# Altium schematic sheet Sheet1.SchDoc
size A
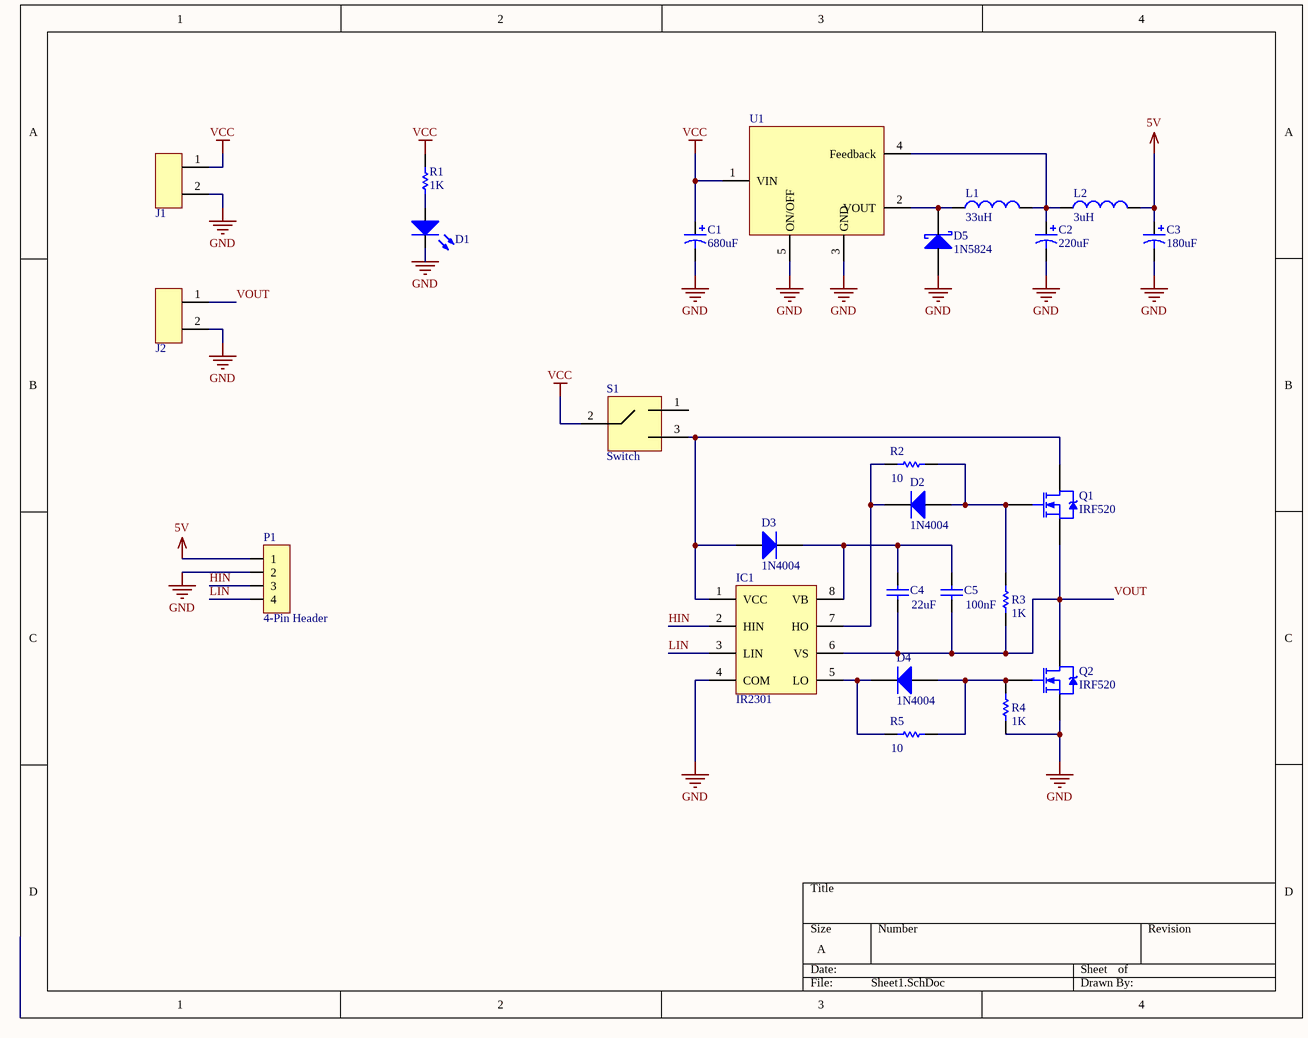
[diagram p0: Sheet1.SchDoc]

## Parts
C1  value 680uF  [EEU-FM1V681]  (hidden comment: Cap Pol1)
C2  value 220uF  [EEU-FM1V221L]  (hidden comment: Cap Pol1)
C3  value 180uF  [EEU-FR1V181]  (hidden comment: Cap Pol1)
C4  value 22uF  [Axial Cap 0.5mm]  (hidden comment: Cap)
C5  value 100nF  [Axial Cap 0.5mm]  (hidden comment: Cap)
D1  LED  [RAD-0.1]  (value not drawn)
D2  1N4004  [DO-41]
D3  1N4004  [DO-41]
D4  1N4004  [DO-41]
D5  1N5824  [DO-201AD]
IC1  IR2301  [DIP-8]
J1  Screw Terminal  [ST-2]  (value not drawn)
J2  Screw Terminal  [ST-2]  (value not drawn)
L1  value 33uH  [Inductor 2307-V-RC]  (hidden comment: Inductor)
L2  value 3uH  [Inductor Dia: 8.8mm]  (hidden comment: Inductor)
P1  4-Pin Header  [HDR-4P]
Q1  IRF520  [TO-220AB]
Q2  IRF520  [TO-220AB]
R1  Resistance: 1K  [AXIAL-0.3]  (hidden comment: Resistor)
R2  value 10  [AXIAL-0.3]  (hidden comment: Res1)
R3  value 1K  [AXIAL-0.3]  (hidden comment: Res1)
R4  value 1K  [AXIAL-0.3]  (hidden comment: Res1)
R5  value 10  [AXIAL-0.3]  (hidden comment: Res1)
S1  Switch  [E101 Switch]
U1  Step-down switching regulator  [TO-220-5]  (value not drawn)

## Nets
5V: C3.1 L2.2 P1.1
GND: C1.2 C2.2 C3.2 D1.2(K) D5.2 IC1.4(COM) J1.2 J2.2 P1.2 Q2.3(S) R4.1 U1.3(GND) U1.5(ON/OFF)
VCC: C1.1 J1.1 R1.2 S1.2(IN) U1.1(VIN)
HIN: IC1.2(HIN) P1.3
LIN: IC1.3(LIN) P1.4
VOUT: C4.1 C5.1 IC1.6(VS) J2.1 Q1.3(S) Q2.2(D) R3.1
NetC2_1: C2.1 L1.2 L2.1 U1.4(Feedback)
NetC4_2: C4.2 C5.2 D3.2(K) IC1.8(VB)
NetD1_1: D1.1(A) R1.1
NetD2_1: D2.1(A) Q1.1(G) R2.2 R3.2
NetD2_2: D2.2(K) IC1.7(HO) R2.1
NetD3_1: D3.1(A) IC1.1(VCC) Q1.2(D) S1.3(OUT)
NetD4_1: D4.1(A) Q2.1(G) R4.2 R5.2
NetD4_2: D4.2(K) IC1.5(LO) R5.1
NetD5_1: D5.1 L1.1 U1.2(VOUT)

Not connected (* = marked no-connect by the designer): S1 1(OUT)

## Library data of the parts
C1-C3 = Cap Pol1: Polarized Capacitor (Radial); Published: 8-Jun-2000; LatestRevisionDate: 17-Jul-2002; LatestRevisionNote: Re-released for DXP Platform.; PackageReference: RB7.6-15; Publisher: Altium Limited; PackageDescription: Polarized Capacitor (Radial); 2 Leads
C4 C5 = Cap: Capacitor; Published: 8-Jun-2000; LatestRevisionDate: 17-Jul-2002; LatestRevisionNote: Re-released for DXP Platform.; PackageReference: RAD-0.3; Publisher: Altium Limited; PackageDescription: Radial Cap, Thru-Hole; 2 Leads; 0.3 in Pin Spacing
D1 = LED: Generic LED; Color: Red
D2-D4 = Diode 1N4004: 1 Amp General Purpose Rectifier; Published: 8-Jun-2000; LatestRevisionDate: 17-Jul-2002; LatestRevisionNote: Re-released for DXP Platform.; DatasheetVersion: 1998; PackageVersion: Aug-1999; PackageReference: DO-41; Publisher: Altium Limited; PackageDescription: Diode, Axial; Body 5.2 x 2.7 mm (LxDia. max), Lead Dia. 0.86 mm (max); Code_JEDEC: DO-204-AL; ComponentLink1Description: Manufacturer Link; ComponentLink1URL: http://www.fairchildsemi.com/; ComponentLink2Description: Datasheet; ComponentLink2URL: http://www.fairchildsemi.com/ds/1N%2F1N4001.pdf
D5 = Schottky Diode
IC1 = IR2301: High and Low Side Driver
J1 J2 = Screw Terminal: 2 Port Screw Terminal
L1 L2 = Inductor: Code_IEC: 1005; Published: 8-Jun-2000; LatestRevisionDate: 29-May-2009; LatestRevisionNote: IPC-7351 Footprint Added.; PackageReference: 0402-A; Publisher: Altium Limited; PackageDescription: Chip Inductor; Code_JEITA: 0402
P1 = HDR_1x4
Q1 Q2 = NMOS-2: N-Channel Power MOSFET; Note: Pin 2 is electrically connected to pin 4.; Published: 8-Jun-2000; LatestRevisionDate: 17-Jul-2002; LatestRevisionNote: Re-released for DXP Platform.; DatasheetVersion: PD-9.814; PackageVersion: Feb-1997; PackageReference: TO-220AB; Publisher: Altium Limited; PackageDescription: TO, Thru-Hole, Vertical, Heatsink Mounted; 3 In-Line Leads; Pitch 2.54 mm; ComponentLink1Description: Manufacturer Link; ComponentLink1URL: http://www.irf.com/
R1 = Resistor: Generic Resistor
R2-R5 = Res1: Resistor; Published: 8-Jun-2000; LatestRevisionDate: 17-Jul-2002; LatestRevisionNote: Re-released for DXP Platform.; PackageReference: AXIAL-0.3; Publisher: Altium Limited; PackageDescription: Axial Device, Thru-Hole; 2 Leads; 0.3 in Pin Spacing
U1 = LM2596